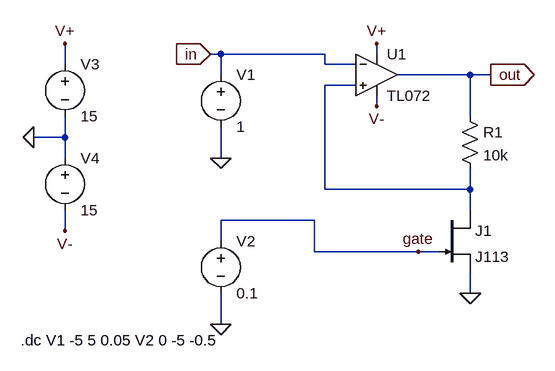
[diagram p0: schematic 2023-04-09 analog multiplier jfet.asc]
2023-04-09 analog multiplier jfet.asc, the LTspice schematic file:
Version 4
SHEET 1 880 680
WIRE -16 128 -32 128
WIRE 144 128 -16 128
WIRE 224 128 224 112
WIRE -256 144 -256 112
WIRE 144 144 144 128
WIRE 192 144 144 144
WIRE -16 160 -16 128
WIRE 368 160 256 160
WIRE 400 160 368 160
WIRE 192 176 144 176
WIRE 224 208 224 192
WIRE 368 224 368 160
WIRE -256 256 -256 224
WIRE -256 256 -304 256
WIRE -256 288 -256 256
WIRE -16 288 -16 240
WIRE 144 336 144 176
WIRE 368 336 368 304
WIRE 368 336 144 336
WIRE 368 368 368 336
WIRE 128 384 -16 384
WIRE -256 400 -256 368
WIRE -16 416 -16 384
WIRE 128 432 128 384
WIRE 288 432 128 432
WIRE 320 432 288 432
WIRE 368 496 368 464
WIRE -16 544 -16 496
FLAG -304 256 0
FLAG -256 112 V+
FLAG -256 400 V-
FLAG 368 496 0
FLAG 224 112 V+
FLAG 224 208 V-
FLAG -16 544 0
FLAG -16 288 0
FLAG -32 128 in
IOPIN -32 128 In
FLAG 400 160 out
IOPIN 400 160 Out
FLAG 288 432 gate
SYMBOL voltage -16 144 R0
WINDOW 123 0 0 Left 0
WINDOW 39 0 0 Left 0
SYMATTR InstName V1
SYMATTR Value 1
SYMBOL voltage -16 400 R0
WINDOW 123 0 0 Left 0
WINDOW 39 0 0 Left 0
SYMATTR InstName V2
SYMATTR Value 0.1
SYMBOL voltage -256 128 R0
WINDOW 123 0 0 Left 0
WINDOW 39 0 0 Left 0
SYMATTR InstName V3
SYMATTR Value 15
SYMBOL voltage -256 272 R0
WINDOW 123 0 0 Left 0
WINDOW 39 0 0 Left 0
SYMATTR InstName V4
SYMATTR Value 15
SYMBOL njf 320 368 R0
SYMATTR InstName J1
SYMATTR Value J113
SYMBOL custom\\TL072 224 160 R0
SYMATTR InstName U1
SYMBOL res 352 208 R0
SYMATTR InstName R1
SYMATTR Value 10k
TEXT -324 568 Left 2 !.dc V1 -5 5 0.05 V2 0 -5 -0.5

The netlist it stands for:
* 2023-04-09 analog multiplier jfet.asc
V1 in 0 1
V2 gate 0 0.1
V3 V+ 0 15
V4 0 V- 15
J1 N001 gate 0 J113
* U1: TL072 (symbol custom\TL072 not available, pins judged from their places): In+=N001 In-=in V+=V+ V-=V- OUT=out
R1 out N001 10k
.model NJF NJF
.model PJF PJF
.lib standard.jft
.dc V1 -5 5 0.05 V2 0 -5 -0.5
.backanno
.end